# Altium schematic sheet Cap 100pF 50V.schdoc
size 43 x 29 mm
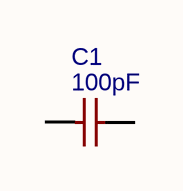
[diagram p0: Cap 100pF 50V.schdoc]

## Parts
C1  100pF  [C0603]

## Nets

Not connected (* = marked no-connect by the designer): C1 1 2

## Library data of the parts
C1 = 100pF: Manufacturer: muRata(村田); Manufacturer Part: GCM1885C1H101JA16D; nameAlias: Value; Supplier: LCSC; Supplier Part: C126543; JLCPCB Part Class: Extended Part; spicePre: C; spiceSymbolName: GCM1885C1H101JA16D